# Altium project Virtex.PrjPcb (part 3 of 3)

## Sheet BoardB-USB.SchDoc
size A; SheetNumber: 6; SheetTotal: 9
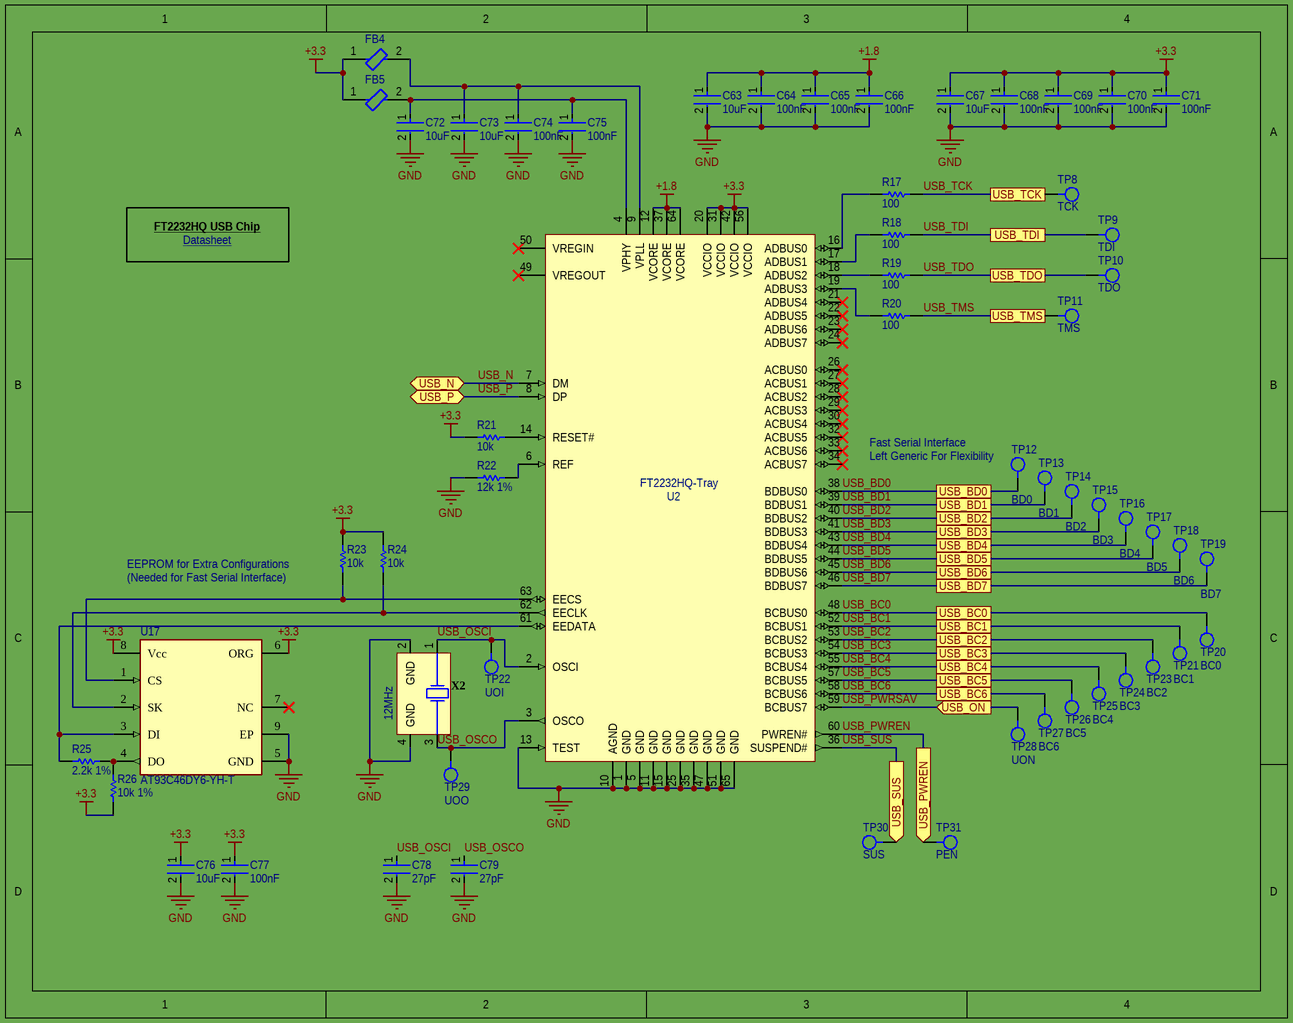
[diagram p5: BoardB-USB.SchDoc]

### Parts
C63  10uF  [FP-GRM188-0_1-e0_2_0_55-IPC_A]
C64  100nF  [FP-CGA3E-0_3-0_1-IPC_A]
C65  100nF  [FP-CGA3E-0_3-0_1-IPC_A]
C66  100nF  [FP-CGA3E-0_3-0_1-IPC_A]
C67  10uF  [FP-GRM188-0_1-e0_2_0_55-IPC_A]
C68  100nF  [FP-CGA3E-0_3-0_1-IPC_A]
C69  100nF  [FP-CGA3E-0_3-0_1-IPC_A]
C70  100nF  [FP-CGA3E-0_3-0_1-IPC_A]
C71  100nF  [FP-CGA3E-0_3-0_1-IPC_A]
C72  10uF  [FP-GRM188-0_1-e0_2_0_55-IPC_A]
C73  10uF  [FP-GRM188-0_1-e0_2_0_55-IPC_A]
C74  100nF  [FP-CGA3E-0_3-0_1-IPC_A]
C75  100nF  [FP-CGA3E-0_3-0_1-IPC_A]
C76  10uF  [FP-GRM188-0_1-e0_2_0_55-IPC_A]
C77  100nF  [FP-CGA3E-0_3-0_1-IPC_A]
C78  27pF  [FP-C0402-BB-MFG]
C79  27pF  [FP-C0402-BB-MFG]
FB4  BLM18AG601SN1D  [FP-BLM18-0_15-t0_8-MFG]  (value not drawn)
FB5  BLM18AG601SN1D  [FP-BLM18-0_15-t0_8-MFG]  (value not drawn)
R17  100  [RESC1005X40X25ML05T10]
R18  100  [RESC1005X40X25ML05T10]
R19  100  [RESC1005X40X25ML05T10]
R20  100  [RESC1005X40X25ML05T10]
R21  10k  [RESC1005X40X25LL05T05]
R22  12k 1%  [RESC1005X40X25ML05T05]
R23  10k  [RESC1005X40X25LL05T05]
R24  10k  [RESC1005X40X25LL05T05]
R25  2.2k 1%  [RESC1005X40X25NL05T10]
R26  10k 1%  [RESC1005X40X25LL05T05]
TP8  TCK  [TestPoint1mm]
TP9  TDI  [TestPoint1mm]
TP10  TDO  [TestPoint1mm]
TP11  TMS  [TestPoint1mm]
TP12  BD0  [TestPoint1mm]
TP13  BD1  [TestPoint1mm]
TP14  BD2  [TestPoint1mm]
TP15  BD3  [TestPoint1mm]
TP16  BD4  [TestPoint1mm]
TP17  BD5  [TestPoint1mm]
TP18  BD6  [TestPoint1mm]
TP19  BD7  [TestPoint1mm]
TP20  BC0  [TestPoint1mm]
TP21  BC1  [TestPoint1mm]
TP22  UOI  [TestPoint1mm]
TP23  BC2  [TestPoint1mm]
TP24  BC3  [TestPoint1mm]
TP25  BC4  [TestPoint1mm]
TP26  BC5  [TestPoint1mm]
TP27  BC6  [TestPoint1mm]
TP28  UON  [TestPoint1mm]
TP29  UOO  [TestPoint1mm]
TP30  SUS  [TestPoint1mm]
TP31  PEN  [TestPoint1mm]
U2  FT2232HQ-Tray  [QFN64_2_N]
U17  AT93C46DY6-YH-T  [FP-C04-21355-Q4B-IPC_C]
X2  ABM8G-12.000MHZ-4Y-T3  [ABM8G-12.000MHZ-4Y-T3]  (value not drawn)

### Ports
USB_BC0, USB_BC1, USB_BC2, USB_BC3, USB_BC4, USB_BC5, USB_BC6, USB_BD0, USB_BD1, USB_BD2, USB_BD3, USB_BD4, USB_BD5, USB_BD6, USB_BD7, USB_N (bidir), USB_ON (in), USB_P (bidir), USB_PWREN (out), USB_SUS (out), USB_TCK, USB_TDI, USB_TDO, USB_TMS

### Nets
+1.8: C63.1 C64.1 C65.1 C66.1 U2.12(VCORE) U2.37(VCORE) U2.64(VCORE)
+3.3: C67.1 C68.1 C69.1 C70.1 C71.1 C76.1 C77.1 FB4.1 FB5.1 R21.2 R23.2 R24.2 R26.1 U2.20(VCCIO) U2.31(VCCIO) U2.42(VCCIO) U2.56(VCCIO) U17.6(ORG) U17.8(Vcc)
GND: C63.2 C64.2 C65.2 C66.2 C67.2 C68.2 C69.2 C70.2 C71.2 C72.2 C73.2 C74.2 C75.2 C76.2 C77.2 C78.2 C79.2 R22.1 U2.1(GND) U2.5(GND) U2.10(AGND) U2.11(GND) U2.13(TEST) U2.15(GND) U2.25(GND) U2.35(GND) U2.47(GND) U2.51(GND) U2.65(GND) U17.5(GND) U17.9(EP) X2.2(GND) X2.4(GND)
USB_BC0: TP20.1 U2.48(BCBUS0) ; port USB_BC0
USB_BC1: TP21.1 U2.52(BCBUS1) ; port USB_BC1
USB_BC2: TP23.1 U2.53(BCBUS2) ; port USB_BC2
USB_BC3: TP24.1 U2.54(BCBUS3) ; port USB_BC3
USB_BC4: TP25.1 U2.55(BCBUS4) ; port USB_BC4
USB_BC5: TP26.1 U2.57(BCBUS5) ; port USB_BC5
USB_BC6: TP27.1 U2.58(BCBUS6) ; port USB_BC6
USB_BD0: TP12.1 U2.38(BDBUS0) ; port USB_BD0
USB_BD1: TP13.1 U2.39(BDBUS1) ; port USB_BD1
USB_BD2: TP14.1 U2.40(BDBUS2) ; port USB_BD2
USB_BD3: TP15.1 U2.41(BDBUS3) ; port USB_BD3
USB_BD4: TP16.1 U2.43(BDBUS4) ; port USB_BD4
USB_BD5: TP17.1 U2.44(BDBUS5) ; port USB_BD5
USB_BD6: TP18.1 U2.45(BDBUS6) ; port USB_BD6
USB_BD7: TP19.1 U2.46(BDBUS7) ; port USB_BD7
USB_N: U2.7(DM) ; port USB_N
USB_OSCI: C78.1 TP22.1 U2.2(OSCI) X2.1
USB_OSCO: C79.1 TP29.1 U2.3(OSCO) X2.3
USB_P: U2.8(DP) ; port USB_P
USB_PWREN: TP31.1 U2.60(PWREN#) ; port USB_PWREN
USB_PWRSAV: TP28.1 U2.59(BCBUS7) ; port USB_ON
USB_SUS: TP30.1 U2.36(SUSPEND#) ; port USB_SUS
USB_TCK: R17.2 TP8.1 ; port USB_TCK
USB_TDI: R18.2 TP9.1 ; port USB_TDI
USB_TDO: R19.2 TP10.1 ; port USB_TDO
USB_TMS: R20.2 TP11.1 ; port USB_TMS
NetC72_1: C72.1 C75.1 FB5.2 U2.4(VPHY)
NetC73_1: C73.1 C74.1 FB4.2 U2.9(VPLL)
NetR17_1: R17.1 U2.16(ADBUS0)
NetR18_1: R18.1 U2.17(ADBUS1)
NetR19_1: R19.1 U2.18(ADBUS2)
NetR20_1: R20.1 U2.19(ADBUS3)
NetR21_1: R21.1 U2.14(RESET#)
NetR22_2: R22.2 U2.6(REF)
NetR23_1: R23.1 U2.63(EECS) U17.1(CS)
NetR24_1: R24.1 U2.62(EECLK) U17.2(SK)
NetR25_1: R25.1 U2.61(EEDATA) U17.3(DI)
NetR25_2: R25.2 R26.2 U17.4(DO)

Not connected (* = marked no-connect by the designer): U2 21(ADBUS4)* 22(ADBUS5)* 23(ADBUS6)* 24(ADBUS7)* 26(ACBUS0)* 27(ACBUS1)* 28(ACBUS2)* 29(ACBUS3)* 30(ACBUS4)* 32(ACBUS5)* 33(ACBUS6)* 34(ACBUS7)* 49(VREGOUT)* 50(VREGIN)*; U17 7(NC)*

### Notes on the sheet
- FT2232HQ USB Chip
- Datasheet <https://www.ftdichip.com/Support/Documents/DataSheets/ICs/DS_FT2232H.pdf>
- Fast Serial Interface
- (near TP12) Left Generic For Flexibility
- (near R23) EEPROM for Extra Configurations
- (near R23) (Needed for Fast Serial Interface)
- (near X2) 12MHz

### Library data of the parts
C63 C67 C72 C73 C76 = CMP-2006-02792-2: as C1 on sheet BoardA-Connectors; Packaging: Tape and Reel; Voltage Rating (DC): 6.3V; Width: 0.031inch; Termination: SMD/SMT; Dielectric: X5R; Package Quantity: 4000; Voltage Rating: 6.3V; Capacitance: 10uF; Case/Package: 0603; Min Operating Temperature: -55°C; Voltage: 6.3V; Length: 1.6mm; Thickness: 0.035inch; Lead Free: Lead Free; Depth: 0.8mm; Case Code (Imperial): 0603; Max Operating Temperature: 85°C; Material: Ceramic; Height: 0.8mm; Tolerance: 20%; Mount: Surface Mount; REACH SVHC: No SVHC; Radiation Hardening: No; Case Code (Metric): 1608
C64-C66 C68-C71 C74 C75 C77 = CMP-2000-07546-2: as C96 on sheet BoardA-Power; Weight: 7.1E-05oz; Composition: Ceramic; Max Operating Temperature: 125°C; Termination: SMD/SMT; Dielectric: X7R; Length: 1.6mm; Package Quantity: 1; REACH SVHC: No SVHC; Lead Free: Lead Free; Case Code (Metric): 1608; Min Operating Temperature: -55°C; Packaging: Tape and Reel; Tolerance: 10%; Voltage Rating: 50V; Case Code (Imperial): 0603; Capacitance: 100nF; Case/Package: 0603; Voltage Rating (DC): 50V; Depth: 0.8mm; Radiation Hardening: No; Ratings: AEC-Q200; Mount: Surface Mount; Voltage: 50V; Thickness: 0.035inch; Width: 0.8mm; Height: 0.8mm
C78 C79 = CMP-1034-00963-6: CAP CER 27PF 50V C0G/NP0 0402; Manufacturer: Kemet; Manufacturer Part Number: C0402C270J5GACTU; Temperature Coefficient: 15%; Tolerance: 0.05; Temperature Characteristic: C0G; Material: Ceramic; Device Class L1: Passive Components; Device Class L3: Ceramic Capacitors; RoHS: TRUE; Height: 0.55mm; Value: 27 pF; Device Class L2: Capacitors; Capacitance: 27 pF; Automotive: No; Octopart: https://octopart.com/c0402c270j5gactu-kemet-149444; Temperature: -55°C to +125°C; Temperature Range Low: -55°C; Package: C0402-BB; Ipc Land Pattern Name: CAPC10050X50; Category: Cap; Lead Free: Yes; Temperature Range High: +125°C; ComponentLink2URL: https://content.kemet.com/datasheets/KEM_C1002_X7R_SMD.pdf; ComponentLink2Description: Datasheet; Mouser Description: Multilayer Ceramic Capacitor, C Series, 27 pF, - 5%, C0G / NP0, 50 V, 0402 [1005 Metric]; Digikey Description: CAP CER 27PF 50V C0G/NP0 0402; Voltage Rating: 50 V
FB4 FB5 = CMP-0686-00436-3: Chip Ferrite Bead, 0603, 600Ω @ 100MHz, 0.38Ω, 25%, 500mA; Number of Lines: 1; Impedance: 600R; DC Resistance (DCR): 380mR; Material: Steel; Shielding: Unshielded; Max DC Current: 500mA; Termination: SMD/SMT; Military Standard: Not; Number of Circuits: 1; Min Operating Temperature: -55°C; Case Code (Imperial): 0603; Width: 0.8mm; Current Rating: 500mA; Lead Free: Lead Free; Packaging: Tape and Reel; Frequency: 100MHz; Max Operating Temperature: 125°C; DC Current: 500mA; REACH SVHC: No SVHC; Case/Package: 0603; Package Quantity: 1; Height: 0.8mm; Number of Pins: 2; Depth: 0.8mm; Test Frequency: 100MHz; Case Code (Metric): 1608; Tolerance: 25%; Core Material: Ferrite; Weight: 7.1E-05oz; Max Current Rating: 500mA; Radiation Hardening: No; Length: 1.6mm; RoHS Compliant: Yes
R17-R20 = CMP-2002-07344-1: Part Number: RC0402FR-07100RL; Manufacturer: Yageo / Phycomp
R21 R23 R24 R26 = CMP-2000-07588-1: Chip Resistor, 10 KOhm, +/- 1%, 0.1 W, -55 to 155 degC, 0402 (1005 Metric), RoHS, Tape and Reel; Manufacturer: Panasonic; Power Rating: 100mW; Voltage Rating: 50V; Resistance: 10KOhm; Case\/Package: 0402; Temperature Coefficient: 100ppm\/degreesC; RoHSCompliant: True; Lead Free: LeadFree; Package Quantity: 1; Contact Plating: Tin; Length: 1mm; Radiation Hardening: No; REACH SVHC: NoSVHC; Max Operating Temperature: 155degC; Depth: 0.5mm; Case Code (Imperial): 0402; Military Standard: Not; Package Description: 2-Pin Surface Mount Device, Body 1 x 0.5 mm; Termination: SMD/SMT; Case Code (Metric): 1005; Height: 0.35mm; Packaging: TapeandReel; Voltage Rating (DC): 50V; Package Reference: 402; Number of Pins: 2; Tolerance: 1%; Mounting Technology: SurfaceMount; Width: 0.02inch; Mount: SurfaceMount; Datasheet URL: https://industrial.panasonic.com/cdbs/www-data/pdf/RDA0000/AOA0000C304.pdf; Composition: ThickFilm; Datasheet Version: 02/2017; Manufacturer URL: http://www.panasonic.com/; Max Power Dissipation: 100mW; Number of Terminations: 2; Min Operating Temperature: -55degC
R22 = CMP-2002-00646-4: Chip Resistor, 12 KOhm, +/- 1%, 0.1 W, -55 to 155 degC, 0402 (1005 Metric), RoHS, Tape and Reel; PartNumber: ERJ-2RKF1202X; Resistance: 12 KOhm; Voltage Rating: 50 V; Case\/Package: 0402; Power Rating: 100 mW; Length: 1 mm; PackageReference: 0402; DatasheetVersion: 04/2015; ComponentLink2Description: Datasheet; ComponentLink1URL: http://www.panasonic.com/; Pins: 2; Width: 0.5 mm; REACH SVHC: Yes; Packaging: Tape and Reel; Min Operating Temperature: -55 degC; Mounting Technology: Surface Mount; Max Operating Temperature: 155 degC; Case Code (Imperial): 0402; Height: 0.35 mm; Tolerance: 1%; PackageDescription: 2-Pin Surface Mount Device, Body 1 x 0.5 mm; RoHSCompliant: true; ComponentLink1Description: Manufacturer URL; Mount: Surface Mount; ComponentLink2URL: http://industrial.panasonic.com/cdbs/www-data/pdf/RDA0000/AOA0000C86.pdf; Package Quantity: 10000; Case Code (Metric): 1005
R25 = CMP-2002-07567-1: Manufacturer: Yageo / Phycomp; Part Number: RC0402FR-072K2L
TP8-TP31 = TestPoint1mm: Test Point 1mm Diameter
U2 = CMP-0078-00003-3: Dual High Speed USB To Multipurpose UART/FIFO IC, 64-pin QFN, Tray; Manufacturer: FTDI; PackageVersion: Jun-12; ComponentLink2URL: http://www.ftdichip.com/Support/Documents/DataSheets/ICs/DS_FT2232H.pdf; ComponentLink1Description: Manufacturer URL; RevisionNote: DatasheetVersion updated to 2.21 Jun-2012; PackageReference: QFN64_2; PackageDescription: 64-Pin Quad Flat No-Lead, 9 x 9 mm Body, 0.5 mm Pitch, 4.35 x 4.35 mm Exposed Pad; ComponentLink2Description: Datasheet; ComponentLink1URL: http://www.ftdichip.com/; PartNumber: FT2232HQ-Tray; DatasheetVersion: ver 2.21, Jun-2012
U17 = CMP-06313-000080-1: IC EEPROM 1KBIT SPI 8MINI MAP; Frequency: 2MHz; Memory Type: Non-Volatile; Memory Size: 1Kb; Max Operating Temperature: 85°C; RoHS Compliant: Yes; Packaging: Tape and Reel; Min Operating Temperature: -40°C; Mount: Surface Mount
X2 = ABM8G-12.000MHZ-4Y-T3: ABRACON - ABM8G-12.000MHZ-4Y-T3 - CRYSTAL, 12MHZ, 10PF, 3.2 X 2.5MM; ESR (Equivalent Series Resistance): 120R; Frequency Tolerance: 30ppm; Supplier 1: Digi-Key; RoHS: Yes; Stock 1: 11481; Pricing 1: 1=0.67000, 10=0.59600, 50=0.55720, 100=0.49250, 500=0.46656, 1000=0.38880 (USD); Mount: Surface Mount; Case/Package: CSMD; Number of Pins: 4; Min Operating Temperature: -10°C; Max Operating Temperature: 60°C; Frequency: 12MHz; Load Capacitance: 10pF; Packaging: Tape and Reel; Frequency Stability: 30ppm; Series: ABM8G; Series Resistance: 120R; Operating Frequency: 12 MHz; Length: 3.2mm; Width: 0.098inch; Height: 0.039inch; Depth: 2.5mm; REACH SVHC: No SVHC; Lead Free: Lead Free; ComponentLink1URL: https://datasheet.ciiva.com/15116/getdatasheetpartid-719872-15116768.pdf?src-supplier=Verical; ComponentLink1Description: https://datasheet.ciiva.com/15116/getdatasheetpartid-719872-15116768.pdf?src-supplier=Verical; ComponentLink2URL: https://datasheet.ciiva.com/857/abm8g-857959.pdf?src-supplier=Digi-Key; ComponentLink2Description: https://datasheet.ciiva.com/857/abm8g-857959.pdf?src-supplier=Digi-Key; ComponentLink3URL: https://datasheet.ciiva.com/857/abm8g-857960.pdf?src-supplier=Digi-Key; ComponentLink3Description: https://datasheet.ciiva.com/857/abm8g-857960.pdf?src-supplier=Digi-Key; ComponentLink4URL: https://datasheet.ciiva.com/857/abm8g-857961.pdf?src-supplier=Digi-Key; ComponentLink4Description: https://datasheet.ciiva.com/857/abm8g-857961.pdf?src-supplier=Digi-Key; ComponentLink5URL: https://datasheet.ciiva.com/16216/abm8g-16216655.pdf?src-supplier=Future+Electronics; ComponentLink5Description: https://datasheet.ciiva.com/16216/abm8g-16216655.pdf?src-supplier=Future+Electronics; Manufacturer Part Number: ABM8G-12.000MHZ-4Y-T3; Manufacturer: Abracon; Supplier Part Number 1: 535-10901-1-ND; Category: Crystals

## Sheet BoardB-Camera.SchDoc
size A; SheetNumber: 7; SheetTotal: 9
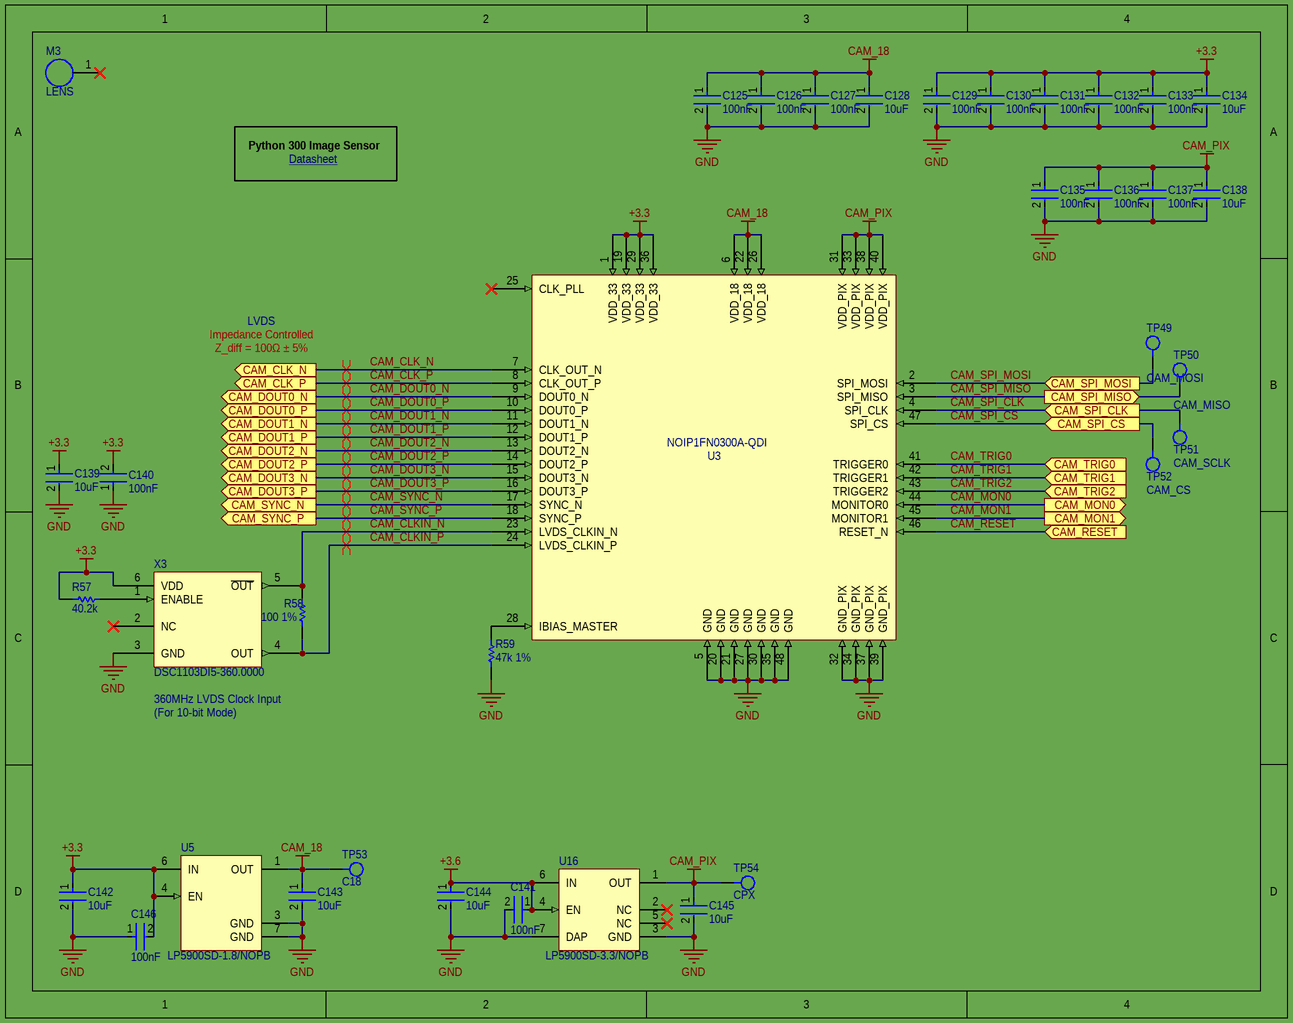
[diagram p6: BoardB-Camera.SchDoc]

### Parts
(Parts that share a designator on the sheet are numbered #1, #2 ... from top to bottom, then left to right.)
C125  100nF  [FP-CGA3E-0_3-0_1-IPC_A]
C126  100nF  [FP-CGA3E-0_3-0_1-IPC_A]
C127  100nF  [FP-CGA3E-0_3-0_1-IPC_A]
C128  10uF  [FP-GRM188-0_1-e0_2_0_55-IPC_A]
C129  100nF  [FP-CGA3E-0_3-0_1-IPC_A]
C130  100nF  [FP-CGA3E-0_3-0_1-IPC_A]
C131  100nF  [FP-CGA3E-0_3-0_1-IPC_A]
C132  100nF  [FP-CGA3E-0_3-0_1-IPC_A]
C133  100nF  [FP-CGA3E-0_3-0_1-IPC_A]
C134  10uF  [FP-GRM188-0_1-e0_2_0_55-IPC_A]
C135  100nF  [FP-CGA3E-0_3-0_1-IPC_A]
C136  100nF  [FP-CGA3E-0_3-0_1-IPC_A]
C137  100nF  [FP-CGA3E-0_3-0_1-IPC_A]
C138  10uF  [FP-GRM188-0_1-e0_2_0_55-IPC_A]
C139  10uF  [FP-GRM188-0_1-e0_2_0_55-IPC_A]
C140  100nF  [FP-CGA3E-0_3-0_1-IPC_A]
C141  100nF  [FP-CGA3E-0_3-0_1-IPC_A]
C142  10uF  [FP-GRM188-0_1-e0_2_0_55-IPC_A]
C143  10uF  [FP-GRM188-0_1-e0_2_0_55-IPC_A]
C144  10uF  [FP-GRM188-0_1-e0_2_0_55-IPC_A]
C145  10uF  [FP-GRM188-0_1-e0_2_0_55-IPC_A]
C146  100nF  [FP-CGA3E-0_3-0_1-IPC_A]
M3  LENS  [LENS_MNT]
R57  40.2k  [RESC1005X40X25LL05T05]
R58  100 1%  [RESC1005X40X25LL05T05]
R59  47k 1%  [RESC1005X40X25NL05T05]
TP49  CAM_MOSI  [TestPoint1mm]
TP50  CAM_MISO  [TestPoint1mm]
TP51  CAM_SCLK  [TestPoint1mm]
TP52  CAM_CS  [TestPoint1mm]
TP53  C18  [TestPoint1mm]
TP54  CPX  [TestPoint1mm]
U3  NOIP1FN0300A-QDI  [NOIP1FN0300A-QDI]
U5#2  LP5900SD-1.8/NOPB  [LP5900-WSON]
U16  LP5900SD-3.3/NOPB  [NGF0006A_V]
X3  DSC1103DI5-360.0000  [DSC1103DI5-360.0000]

### Ports
CAM_CLK_N (out), CAM_CLK_P (out), CAM_DOUT0_N (out), CAM_DOUT0_P (out), CAM_DOUT1_N (out), CAM_DOUT1_P (out), CAM_DOUT2_N (out), CAM_DOUT2_P (out), CAM_DOUT3_N (out), CAM_DOUT3_P (out), CAM_MON0 (out), CAM_MON1 (out), CAM_RESET (in), CAM_SPI_CLK (in), CAM_SPI_CS (in), CAM_SPI_MISO (out), CAM_SPI_MOSI (in), CAM_SYNC_N (out), CAM_SYNC_P (out), CAM_TRIG0 (in), CAM_TRIG1 (in), CAM_TRIG2 (in)

### Nets
+3.3: C129.1 C130.1 C131.1 C132.1 C133.1 C134.1 C139.1 C140.2 C142.1 C146.2 R57.1 U3.1(VDD_33) U3.19(VDD_33) U3.29(VDD_33) U3.36(VDD_33) U5#2.4(EN) U5#2.6(IN) X3.6(VDD)
+3.6: C141.1 C144.1 U16.4(EN) U16.6(IN)
CAM_18: C125.1 C126.1 C127.1 C128.1 C143.1 TP53.1 U3.6(VDD_18) U3.22(VDD_18) U3.26(VDD_18) U5#2.1(OUT)
CAM_PIX: C135.1 C136.1 C137.1 C138.1 C145.1 TP54.1 U3.31(VDD_PIX) U3.33(VDD_PIX) U3.38(VDD_PIX) U3.40(VDD_PIX) U16.1(OUT)
GND: C125.2 C126.2 C127.2 C128.2 C129.2 C130.2 C131.2 C132.2 C133.2 C134.2 C135.2 C136.2 C137.2 C138.2 C139.2 C140.1 C141.2 C142.2 C143.2 C144.2 C145.2 C146.1 R59.1 U3.5(GND) U3.20(GND) U3.21(GND) U3.27(GND) U3.30(GND) U3.32(GND_PIX) U3.34(GND_PIX) U3.35(GND) U3.37(GND_PIX) U3.39(GND_PIX) U3.48(GND) U5#2.3(GND) U5#2.7(GND) U16.3(GND) U16.7(DAP) X3.3(GND)
CAM_CLK_N: U3.7(CLK_OUT_N) ; port CAM_CLK_N
CAM_CLK_P: U3.8(CLK_OUT_P) ; port CAM_CLK_P
CAM_CLKIN_N: R58.2 U3.23(LVDS_CLKIN_N) X3.5(~{OUT})
CAM_CLKIN_P: R58.1 U3.24(LVDS_CLKIN_P) X3.4(OUT)
CAM_DOUT0_N: U3.9(DOUT0_N) ; port CAM_DOUT0_N
CAM_DOUT0_P: U3.10(DOUT0_P) ; port CAM_DOUT0_P
CAM_DOUT1_N: U3.11(DOUT1_N) ; port CAM_DOUT1_N
CAM_DOUT1_P: U3.12(DOUT1_P) ; port CAM_DOUT1_P
CAM_DOUT2_N: U3.13(DOUT2_N) ; port CAM_DOUT2_N
CAM_DOUT2_P: U3.14(DOUT2_P) ; port CAM_DOUT2_P
CAM_DOUT3_N: U3.15(DOUT3_N) ; port CAM_DOUT3_N
CAM_DOUT3_P: U3.16(DOUT3_P) ; port CAM_DOUT3_P
CAM_MON0: U3.44(MONITOR0) ; port CAM_MON0
CAM_MON1: U3.45(MONITOR1) ; port CAM_MON1
CAM_RESET: U3.46(RESET_N) ; port CAM_RESET
CAM_SPI_CLK: TP51.1 U3.4(SPI_CLK) ; port CAM_SPI_CLK
CAM_SPI_CS: TP52.1 U3.47(SPI_CS) ; port CAM_SPI_CS
CAM_SPI_MISO: TP50.1 U3.3(SPI_MISO) ; port CAM_SPI_MISO
CAM_SPI_MOSI: TP49.1 U3.2(SPI_MOSI) ; port CAM_SPI_MOSI
CAM_SYNC_N: U3.17(SYNC_N) ; port CAM_SYNC_N
CAM_SYNC_P: U3.18(SYNC_P) ; port CAM_SYNC_P
CAM_TRIG0: U3.41(TRIGGER0) ; port CAM_TRIG0
CAM_TRIG1: U3.42(TRIGGER1) ; port CAM_TRIG1
CAM_TRIG2: U3.43(TRIGGER2) ; port CAM_TRIG2
NetR57_2: R57.2 X3.1(ENABLE)
NetR59_2: R59.2 U3.28(IBIAS_MASTER)

Not connected (* = marked no-connect by the designer): M3 1*; U3 25(CLK_PLL)*; U16 2(NC)* 5(NC)*; X3 2(NC)*

### Layout directives
differential pair; differential pair class CAM_CLK_OUT; rule Signal Stimulus [Kind - Single Pulse    Level - High    Start Time = 0.000    Stop Time = 1.389n    Period Time = 2.778n]: CAM_CLK_N, CAM_CLK_P
differential pair; differential pair class CAM_DOUT0; rule Signal Stimulus [Kind - Single Pulse    Level - High    Start Time = 0.000    Stop Time = 1.389n    Period Time = 2.778n]: CAM_DOUT0_N, CAM_DOUT0_P
differential pair; differential pair class CAM_DOUT1; rule Signal Stimulus [Kind - Single Pulse    Level - High    Start Time = 0.000    Stop Time = 1.389n    Period Time = 2.778n]: CAM_DOUT1_N, CAM_DOUT1_P
differential pair; differential pair class CAM_DOUT2; rule Signal Stimulus [Kind - Single Pulse    Level - High    Start Time = 0.000    Stop Time = 1.389n    Period Time = 2.778n]: CAM_DOUT2_N, CAM_DOUT2_P
differential pair; differential pair class CAM_DOUT3; rule Signal Stimulus [Kind - Single Pulse    Level - High    Start Time = 0.000    Stop Time = 1.389n    Period Time = 2.778n]: CAM_DOUT3_N, CAM_DOUT3_P
differential pair; differential pair class CAM_SYNC; rule Signal Stimulus [Kind - Single Pulse    Level - High    Start Time = 0.000    Stop Time = 1.389n    Period Time = 2.778n]: CAM_SYNC_N, CAM_SYNC_P
differential pair; differential pair class CAM_CLKIN: CAM_CLKIN_N, CAM_CLKIN_P

### Notes on the sheet
- Python 300 Image Sensor
- Datasheet <https://www.onsemi.com/pdf/datasheet/noip1sn1300a-d.pdf>
- LVDS
- Impedance Controlled
- Z_diff = 100Ω ± 5%
- (near X3) 360MHz LVDS Clock Input
- (For 10-bit Mode)

### Library data of the parts
C125-C127 C129-C133 C135-C137 C140 C141 C146 = CMP-2000-07546-2: Cap Ceramic 100nF 50V X7R 10% Pad SMD 0603 +125°C Automotive T/R; Weight: 7.1E-05oz; Composition: Ceramic; Max Operating Temperature: 125°C; Termination: SMD/SMT; Dielectric: X7R; Length: 1.6mm; Package Quantity: 1; REACH SVHC: No SVHC; Lead Free: Lead Free; Case Code (Metric): 1608; Min Operating Temperature: -55°C; Packaging: Tape and Reel; Tolerance: 10%; Voltage Rating: 50V; Case Code (Imperial): 0603; Capacitance: 100nF; Case/Package: 0603; Voltage Rating (DC): 50V; Depth: 0.8mm; Radiation Hardening: No; Ratings: AEC-Q200; Mount: Surface Mount; Voltage: 50V; Thickness: 0.035inch; Width: 0.8mm; Height: 0.8mm
C128 C134 C138 C139 C142-C145 = CMP-2006-02792-2: Chip Multilayer Ceramic Capacitors for General Purpose, 0603, 10uF, X5R, 15%, 20%, 6.3V; Packaging: Tape and Reel; Voltage Rating (DC): 6.3V; Width: 0.031inch; Termination: SMD/SMT; Dielectric: X5R; Package Quantity: 4000; Voltage Rating: 6.3V; Capacitance: 10uF; Case/Package: 0603; Min Operating Temperature: -55°C; Voltage: 6.3V; Length: 1.6mm; Thickness: 0.035inch; Lead Free: Lead Free; Depth: 0.8mm; Case Code (Imperial): 0603; Max Operating Temperature: 85°C; Material: Ceramic; Height: 0.8mm; Tolerance: 20%; Mount: Surface Mount; REACH SVHC: No SVHC; Radiation Hardening: No; Case Code (Metric): 1608
M3 = LENS_MNT
R57 = CMP-2002-00919-1: Manufacturer: Panasonic; Part Number: ERJ-2RKF4022X
R58 = CMP-2002-00605-3: Chip Resistor, 100 Ohm, +/- 1%, 100 mW, -55 to 155 degC, 0402 (1005 Metric), RoHS, Tape and Reel; Manufacturer: Basic Passives; PartNumber: ERJ-2RKF1000X; Power Rating: 100 mW; Resistance: 100 Ohm; Voltage Rating: 50 V; Case\/Package: 0402; Width: 0.5 mm; Pins: 2; ComponentLink2Description: Datasheet; PackageReference: 0402; Height: 0.35 mm; Tolerance: 1%; DatasheetVersion: 04/2015; Case Code (Imperial): 0402; Min Operating Temperature: -55 degC; Radiation Hardening: No; Length: 1 mm; Package Quantity: 10000; PackageDescription: 2-Pin Surface Mount Device, Body 1 x 0.5 mm; Mounting Technology: Surface Mount; Case Code (Metric): 1005; Packaging: Tape and Reel; ComponentLink1URL: http://www.panasonic.com/; RoHSCompliant: true; Max Operating Temperature: 155 degC; REACH SVHC: Yes; ComponentLink1Description: Manufacturer URL; ComponentLink2URL: http://industrial.panasonic.com/cdbs/www-data/pdf/RDA0000/AOA0000C86.pdf; Mount: Surface Mount
R59 = CMP-2002-01155-1: Part Number: ERJ2RKF4702X; Manufacturer: Panasonic
TP49-TP54 = TestPoint1mm: Test Point 1mm Diameter
U3 = NOIP1FN0300A-QDI: IC IMAGE SENSOR 0.3MP 48LCC; Manufacturer: ON Semiconductor; Operating Supply Voltage: 3.4V; Supplier 1: Avnet; Manufacturer Part Number: NOIP1FN0300A-QDI; RoHS: Yes; Category: Optoelectronics; Pricing 1: 6=58.23675, 8=57.37875, 20=56.62800, 30=55.87725, 60=55.12650, 300=53.83950, 600=53.41050 (USD); Mount: Surface Mount; Case/Package: LCC; Number of Pins: 48; Min Operating Temperature: -40°C; Max Operating Temperature: 85°C; Lead Free: Lead Free; RoHS Compliant: Yes; ComponentLink1URL: http://www.onsemi.com/pub_link/Collateral/PB_NOIP1SN1300A-D.PDF?src-supplier=Digi-Key; ComponentLink1Description: http://www.onsemi.com/pub_link/Collateral/PB_NOIP1SN1300A-D.PDF?src-supplier=Digi-Key; ComponentLink2URL: http://www.onsemi.com/pub_link/Collateral/NOIP1SN1300A-D.PDF?src-supplier=Avnet+Asia; ComponentLink2Description: http://www.onsemi.com/pub_link/Collateral/NOIP1SN1300A-D.PDF?src-supplier=Avnet+Asia; Supplier Part Number 1: NOIP1FN0300A-QDI
U5#2 = LP5900SD-1.8/NOPB: TEXAS INSTRUMENTS         LP5900SD-1.8/NOPB.             LDO VOLTAGE REGULATOR, 3.3V, 150mA, LLP-6, FULL REEL; Output Voltage: 1.8V; Min Input Voltage: 2.5V; Max Input Voltage: 5.5V; Number of Outputs: 1; Polarity: Positive; Quiescent Current: 50uA; Accuracy: 2%; Output Type: Fixed; Dropout Voltage: 150mV; Supplier 1: Digi-Key; RoHS: Yes; Stock 1: 9836; Pricing 1: 1=0.87000, 10=0.77000, 25=0.72280, 100=0.59000, 250=0.54800, 500=0.46640 (USD); Mount: Surface Mount; Number of Pins: 6; Min Operating Temperature: -40°C; Max Operating Temperature: 125°C; Output Current: 150mA; Package Quantity: 1000; Max Output Current: 150mA; Nominal Output Voltage: 1.8V; Packaging: Tape and Reel; Output Voltage Accuracy: 2%; Length: 2.2mm; Width: 2.5mm; Height: 0.8mm; Radiation Hardening: No; REACH SVHC: No SVHC; Lead Free: Lead Free; RoHS Compliant: Yes; ComponentLink1URL: https://datasheet.ciiva.com/6598/lp5900-6598182.pdf?src-supplier=Digi-Key; ComponentLink1Description: https://datasheet.ciiva.com/6598/lp5900-6598182.pdf?src-supplier=Digi-Key; ComponentLink2URL: https://datasheet.ciiva.com/6598/lp5900-6598185.pdf?src-supplier=Digi-Key; ComponentLink2Description: https://datasheet.ciiva.com/6598/lp5900-6598185.pdf?src-supplier=Digi-Key; ComponentLink3URL: https://datasheet.ciiva.com/6598/lp5900-6598187.pdf?src-supplier=Digi-Key; ComponentLink3Description: https://datasheet.ciiva.com/6598/lp5900-6598187.pdf?src-supplier=Digi-Key; ComponentLink4URL: https://datasheet.ciiva.com/26175/lp5900-26175289.pdf?src-supplier=Avnet+Europe; ComponentLink4Description: https://datasheet.ciiva.com/26175/lp5900-26175289.pdf?src-supplier=Avnet+Europe; ComponentLink5URL: https://datasheet.ciiva.com/14278/lp5900-14278125.pdf?src-supplier=Avnet; ComponentLink5Description: https://datasheet.ciiva.com/14278/lp5900-14278125.pdf?src-supplier=Avnet; ComponentLink6URL: https://datasheet.ciiva.com/28643/1772310-28643116.pdf?src-supplier=Element14; ComponentLink6Description: https://datasheet.ciiva.com/28643/1772310-28643116.pdf?src-supplier=Element14; ComponentLink7URL: https://datasheet.ciiva.com/22678/1772310-22678013.pdf?src-supplier=Element14; ComponentLink7Description: https://datasheet.ciiva.com/22678/1772310-22678013.pdf?src-supplier=Element14; Category: Voltage Regulators - Linear; Manufacturer Part Number: LP5900SD-1.8/NOPB; Manufacturer: Texas Instruments; Supplier Part Number 1: LP5900SD-1.8/NOPBCT-ND
U16 = CMP-0062-01367-3: Ultra Low Noise, 150mA Linear Regulator for RF/Analog Circuits Requires No Bypass Capacitor, 6-pin LLP, Pb-Free; Manufacturer: Texas Instruments; PackageTopMarking: XTT*L16; CompType: LDO IC; PowerWise: N; ComponentLink1URL: http://www.ti.com/general/docs/lit/getliterature.tsp?genericPartNumber=LP5900&fileType=pdf; PinCount: 6; PackageDescription: LLP, Plastic, Dual, 2.2 x 2.5 x 0.8mm Body, 6 Lead, 0.65mm Pitch, No Pullback; RoHS: Y; ComponentLink1Description: Datasheet URL; PackageReference: NGF0006A
X3 = DSC1103DI5-360.0000: Mems Oscillator, Low Power, Lvds, -40C-85C, 10Ppm, 2.5X2.0Mm6 Vdfn 2.0X2.5Mm Tube; Manufacturer: Microchip; Supplier 1: Digi-Key; Manufacturer Part Number: DSC1103DI5-360.0000; RoHS: Yes; Category: Oscillators; Stock 1: 706; Pricing 1: 1=5.51000, 25=4.59000, 100=4.51500 (USD); RoHS Compliant: Yes; Supplier Part Number 1: DSC1103DI5-360.0000-ND

## Sheet BoardB-LEDs.SchDoc
size A; SheetNumber: 8; SheetTotal: 9
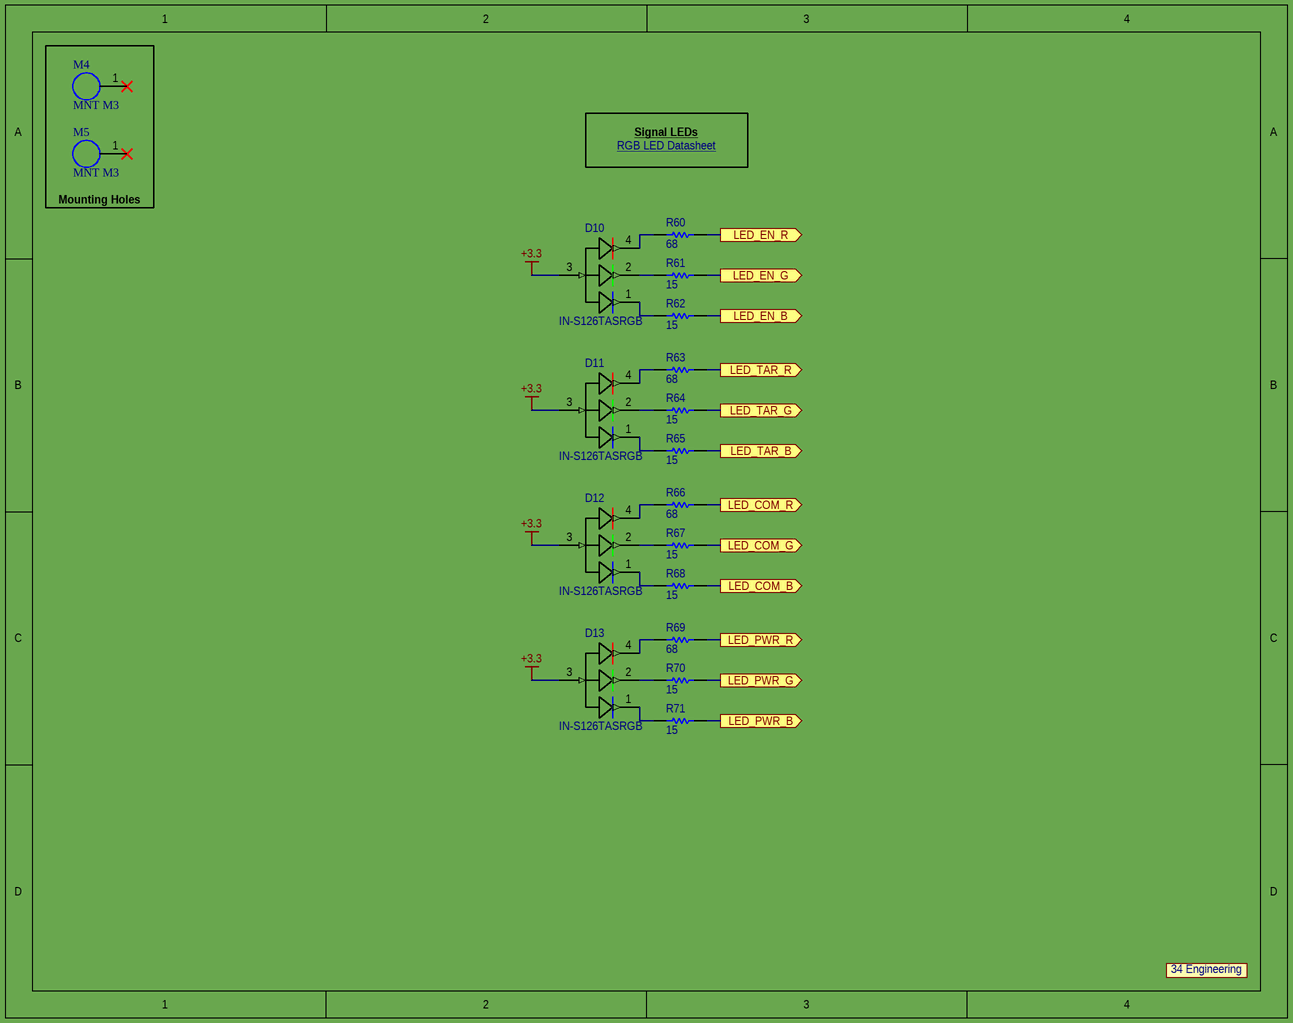
[diagram p7: BoardB-LEDs.SchDoc]

### Parts
D10  IN-S126TASRGB  [IN-S126TASRGB]
D11  IN-S126TASRGB  [IN-S126TASRGB]
D12  IN-S126TASRGB  [IN-S126TASRGB]
D13  IN-S126TASRGB  [IN-S126TASRGB]
LOGO1  34 Engineering Logo  [34EngineeringLogo]  (value not drawn)
M4  MNT M3  [MNT M3]
M5  MNT M3  [MNT M3]
R60  68  [RESC1005X40X25ML05T05]
R61  15  [RESC1005X40X25LL05T05]
R62  15  [RESC1005X40X25LL05T05]
R63  68  [RESC1005X40X25ML05T05]
R64  15  [RESC1005X40X25LL05T05]
R65  15  [RESC1005X40X25LL05T05]
R66  68  [RESC1005X40X25ML05T05]
R67  15  [RESC1005X40X25LL05T05]
R68  15  [RESC1005X40X25LL05T05]
R69  68  [RESC1005X40X25ML05T05]
R70  15  [RESC1005X40X25LL05T05]
R71  15  [RESC1005X40X25LL05T05]

### Blocks framed on the sheet
Mounting Holes: M4 M5

### Ports
LED_COM_B (out), LED_COM_G (out), LED_COM_R (out), LED_EN_B (out), LED_EN_G (out), LED_EN_R (out), LED_PWR_B (out), LED_PWR_G (out), LED_PWR_R (out), LED_TAR_B (out), LED_TAR_G (out), LED_TAR_R (out)

### Nets
+3.3: D10.3 D11.3 D12.3 D13.3
NetD10_1: D10.1 R62.1
NetD10_2: D10.2 R61.1
NetD10_4: D10.4 R60.1
NetD11_1: D11.1 R65.1
NetD11_2: D11.2 R64.1
NetD11_4: D11.4 R63.1
NetD12_1: D12.1 R68.1
NetD12_2: D12.2 R67.1
NetD12_4: D12.4 R66.1
NetD13_1: D13.1 R71.1
NetD13_2: D13.2 R70.1
NetD13_4: D13.4 R69.1
NetR60_2: R60.2 ; port LED_EN_R
NetR61_2: R61.2 ; port LED_EN_G
NetR62_2: R62.2 ; port LED_EN_B
NetR63_2: R63.2 ; port LED_TAR_R
NetR64_2: R64.2 ; port LED_TAR_G
NetR65_2: R65.2 ; port LED_TAR_B
NetR66_2: R66.2 ; port LED_COM_R
NetR67_2: R67.2 ; port LED_COM_G
NetR68_2: R68.2 ; port LED_COM_B
NetR69_2: R69.2 ; port LED_PWR_R
NetR70_2: R70.2 ; port LED_PWR_G
NetR71_2: R71.2 ; port LED_PWR_B

Not connected (* = marked no-connect by the designer): M4 1*; M5 1*

### Notes on the sheet
- Signal LEDs
- RGB LED Datasheet <http://www.inolux-corp.com/datasheet/SMDLED/RGB%20Side%20View/IN-S126TASRGB_V1.1.pdf>
- (in symbol 34EngineeringLogo) 34 Engineering

### Library data of the parts
D10-D13 = IN-S126TASRGB: LED Tri-Color Blue/Green/Red 470nm/523nm/625nm Automotive 4-Pin Chip 1206(3216Metric) T/R; Manufacturer: Inolux; Supplier 1: Digi-Key; Manufacturer Part Number: IN-S126TASRGB; RoHS: No; Category: LEDs; Stock 1: 49322; Pricing 1: 1=0.58000, 10=0.37900, 100=0.25070, 1000=0.19356 (USD); Supplier Part Number 1: 1830-1052-1-ND
LOGO1 = 34EngineeringLogo: 34 Engineering Silkscreen Logo
M4 M5 = MNT M3: Mounting hole for an M3 bolt
R60 R63 R66 R69 = CMP-2002-01170-1: Manufacturer: Panasonic; Part Number: ERJ2RKF68R0X
R61 R62 R64 R65 R67 R68 R70 R71 = CMP-1011-00302-2: Manufacturer: Panasonic; Part Number: ERJ-2RKF15R0X

## Sheet BoardC.SchDoc
size A; SheetNumber: 9; SheetTotal: 9
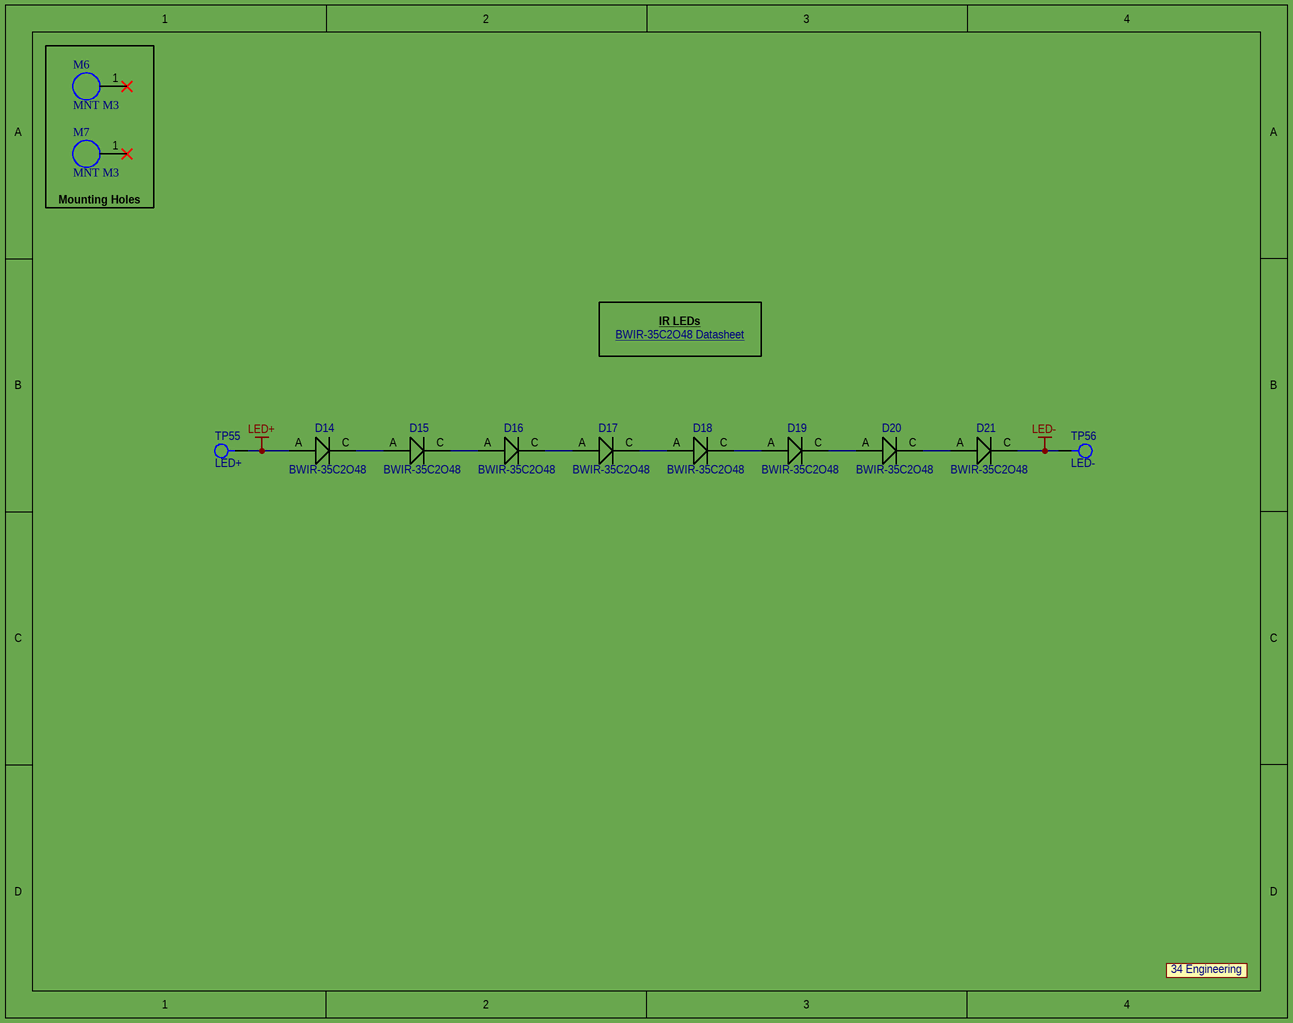
[diagram p8: BoardC.SchDoc]

### Parts
D14  BWIR-35C2O48  [BWIR-35C2O48]
D15  BWIR-35C2O48  [BWIR-35C2O48]
D16  BWIR-35C2O48  [BWIR-35C2O48]
D17  BWIR-35C2O48  [BWIR-35C2O48]
D18  BWIR-35C2O48  [BWIR-35C2O48]
D19  BWIR-35C2O48  [BWIR-35C2O48]
D20  BWIR-35C2O48  [BWIR-35C2O48]
D21  BWIR-35C2O48  [BWIR-35C2O48]
LOGO2  34 Engineering Logo  [34EngineeringLogo]  (value not drawn)
M6  MNT M3  [MNT M3]
M7  MNT M3  [MNT M3]
TP55  LED+  [TestPoint1mm]
TP56  LED-  [TestPoint1mm]

### Blocks framed on the sheet
Mounting Holes: M6 M7

### Nets
LED+: D14.A TP55.1
LED-: D21.C TP56.1
NetD14_C: D14.C D15.A
NetD15_C: D15.C D16.A
NetD16_C: D16.C D17.A
NetD17_C: D17.C D18.A
NetD18_C: D18.C D19.A
NetD19_C: D19.C D20.A
NetD20_C: D20.C D21.A

Not connected (* = marked no-connect by the designer): M6 1*; M7 1*

### Notes on the sheet
- IR LEDs
- BWIR-35C2O48 Datasheet <https://www.americanbrightled.com/pdffiles/ir-uv/ir/BWIR-35C2O48.pdf>
- (in symbol 34EngineeringLogo) 34 Engineering

### Library data of the parts
D14-D21 = BWIR-35C2O48: Infrared (IR) Emitter 850nm 1.7V 1A 260mW/sr @ 1A (Typ) 120° 1414 (3535 Metric); Manufacturer: American Bright; Supplier 1: Digi-Key; Manufacturer Part Number: BWIR-35C2O48; RoHS: No; Stock 1: 22417; Pricing 1: 1=2.11000, 10=1.40800, 100=1.08350, 500=0.97944, 1000=0.86625 (USD); Packaging: Tape and Reel; Supplier Part Number 1: BWIR-35C2O48CT-ND
LOGO2 = 34EngineeringLogo: 34 Engineering Silkscreen Logo
M6 M7 = MNT M3: Mounting hole for an M3 bolt
TP55 TP56 = TestPoint1mm: Test Point 1mm Diameter

## Nets that join several sheets
+1: BoardB-FPGA2 (17 pins), BoardB-FPGA3 (C?#52.1 TP?#13.1 U?#2.1)
+1.8: BoardB-FPGA2 (11 pins), BoardB-FPGA3 (C?#61.1 TP?#16.1 U?#5.1), BoardB-USB (7 pins)
+2.5: BoardB-FPGA2 (13 pins), BoardB-FPGA3 (C?#59.1 TP?#15.1 U?#4.1)
+3.3: BoardA-Power (10 pins), BoardA-Connectors (9 pins), BoardB-FPGA (C16.1 C17.1 R76.2 X1.1), BoardB-FPGA2 (43 pins), BoardB-FPGA3 (26 pins), BoardB-USB (19 pins), BoardB-Camera (18 pins), BoardB-LEDs (D10.3 D11.3 D12.3 D13.3)
+3.6: BoardA-Power (C98.1 U14.5), BoardB-Camera (C141.1 C144.1 U16.4 U16.6)
GND: BoardA-Power (38 pins), BoardA-Connectors (30 pins), BoardB-FPGA (6 pins), BoardB-FPGA2 (81 pins), BoardB-FPGA3 (24 pins), BoardB-USB (33 pins), BoardB-Camera (39 pins)
LED+: BoardA-Power (8 pins), BoardC (D14.A TP55.1)
LED-: BoardA-Power (5 pins), BoardC (D21.C TP56.1)
VCC: BoardA-Power (19 pins), BoardA-Connectors (6 pins)
CAM_CLK_N: BoardB-FPGA (U1.E5), BoardB-Camera (U3.7)
CAM_CLK_P: BoardB-FPGA (U1.F5), BoardB-Camera (U3.8)
CAM_DOUT0_N: BoardB-FPGA (U1.H4), BoardB-Camera (U3.9)
CAM_DOUT0_P: BoardB-FPGA (U1.H5), BoardB-Camera (U3.10)
CAM_DOUT1_N: BoardB-FPGA (U1.G1), BoardB-Camera (U3.11)
CAM_DOUT1_P: BoardB-FPGA (U1.G2), BoardB-Camera (U3.12)
CAM_DOUT2_N: BoardB-FPGA (U1.G4), BoardB-Camera (U3.13)
CAM_DOUT2_P: BoardB-FPGA (U1.G5), BoardB-Camera (U3.14)
CAM_DOUT3_N: BoardB-FPGA (U1.E1), BoardB-Camera (U3.15)
CAM_DOUT3_P: BoardB-FPGA (U1.F2), BoardB-Camera (U3.16)
CAM_MON0: BoardB-FPGA (U1.D16), BoardB-Camera (U3.44)
CAM_MON1: BoardB-FPGA (U1.F12), BoardB-Camera (U3.45)
CAM_RESET: BoardB-FPGA (U1.D15), BoardB-Camera (U3.46)
CAM_SPI_CLK: BoardB-FPGA (U1.E13), BoardB-Camera (TP51.1 U3.4)
CAM_SPI_CS: BoardB-FPGA (U1.E11), BoardB-Camera (TP52.1 U3.47)
CAM_SPI_MISO: BoardB-FPGA (U1.D14), BoardB-Camera (TP50.1 U3.3)
CAM_SPI_MOSI: BoardB-FPGA (U1.D11), BoardB-Camera (TP49.1 U3.2)
CAM_SYNC_N: BoardB-FPGA (U1.F3), BoardB-Camera (U3.17)
CAM_SYNC_P: BoardB-FPGA (U1.F4), BoardB-Camera (U3.18)
CAM_TRIG0: BoardB-FPGA (U1.E16), BoardB-Camera (U3.41)
CAM_TRIG1: BoardB-FPGA (U1.F13), BoardB-Camera (U3.42)
CAM_TRIG2: BoardB-FPGA (U1.F15), BoardB-Camera (U3.43)
CONF_CLK: BoardB-FPGA (U1.N13), BoardB-FPGA3 (TP?#11.1 U5#1.6)
CONF_CS: BoardB-FPGA (U1.P16), BoardB-FPGA3 (R?#16.1 TP?#7.1 U5#1.1)
CONF_HOLD: BoardB-FPGA (U1.T14), BoardB-FPGA3 (R?#17.2 TP?#9.1)
CONF_MISO: BoardB-FPGA (U1.R15), BoardB-FPGA3 (R?#18.1 TP?#8.1)
CONF_MOSI: BoardB-FPGA (U1.T15), BoardB-FPGA3 (R?#22.2 TP?#12.1)
CONF_WP: BoardB-FPGA (U1.R16), BoardB-FPGA3 (R?#21.1 TP?#10.1)
FLASH_CLK: BoardB-FPGA2 (U1.E8), BoardB-FPGA3 (TP?#5.1 U?#1.6)
FLASH_CS: BoardB-FPGA (U1.L12), BoardB-FPGA3 (R?#9.1 TP?#1.1 U?#1.1)
FLASH_SIO0: BoardB-FPGA (U1.J13), BoardB-FPGA3 (R?#15.2 TP?#6.1)
FLASH_SIO1: BoardB-FPGA (U1.J14), BoardB-FPGA3 (R?#11.1 TP?#2.1)
FLASH_SIO2: BoardB-FPGA (U1.K15), BoardB-FPGA3 (R?#14.1 TP?#4.1)
FLASH_SIO3: BoardB-FPGA (U1.K16), BoardB-FPGA3 (R?#10.2 TP?#3.1)
NetR1_1: BoardA-Connectors (R1.1 TP1.1 U4.4), BoardB-FPGA (U1.N12)
NetR3_1: BoardA-Connectors (R3.1 TP2.1 U6.4), BoardB-FPGA (U1.N11)
NetR5_1: BoardA-Connectors (R5.1 TP4.1 U7.5), BoardB-FPGA (U1.A13)
NetR7_1: BoardA-Power (U13.12), BoardB-FPGA (R7.1 TP6.1 U1.C8 U1.C9)
NetR51_2: BoardA-Power (R51.2 U13.9), BoardB-FPGA (U1.D10)
NetR60_2: BoardB-FPGA2 (U1.M5 U1.P1), BoardB-LEDs (R60.2)
NetR61_2: BoardB-FPGA2 (U1.N2 U1.P4), BoardB-LEDs (R61.2)
NetR62_2: BoardB-FPGA2 (U1.N1 U1.P3), BoardB-LEDs (R62.2)
NetR63_2: BoardB-FPGA (U1.A8 U1.A9), BoardB-LEDs (R63.2)
NetR64_2: BoardB-FPGA (U1.A10 U1.B9), BoardB-LEDs (R64.2)
NetR65_2: BoardB-FPGA (U1.B10 U1.B11), BoardB-LEDs (R65.2)
NetR66_2: BoardB-FPGA2 (U1.R1 U1.T4), BoardB-LEDs (R66.2)
NetR67_2: BoardB-FPGA2 (U1.N4 U1.R3), BoardB-LEDs (R67.2)
NetR68_2: BoardB-FPGA2 (U1.R2 U1.T2), BoardB-LEDs (R68.2)
NetR69_2: BoardB-FPGA2 (U1.M4 U1.N3), BoardB-LEDs (R69.2)
NetR70_2: BoardB-FPGA2 (U1.L5 U1.M2), BoardB-LEDs (R70.2)
NetR71_2: BoardB-FPGA2 (U1.L4 U1.M1), BoardB-LEDs (R71.2)
USB_BC0: BoardB-FPGA (U1.T5), BoardB-USB (TP20.1 U2.48)
USB_BC1: BoardB-FPGA (U1.P9), BoardB-USB (TP21.1 U2.52)
USB_BC2: BoardB-FPGA (U1.N9), BoardB-USB (TP23.1 U2.53)
USB_BC3: BoardB-FPGA (U1.T10), BoardB-USB (TP24.1 U2.54)
USB_BC4: BoardB-FPGA (U1.R10), BoardB-USB (TP25.1 U2.55)
USB_BC5: BoardB-FPGA (U1.P10), BoardB-USB (TP26.1 U2.57)
USB_BC6: BoardB-FPGA (U1.R11), BoardB-USB (TP27.1 U2.58)
USB_BD0: BoardB-FPGA (U1.P8), BoardB-USB (TP12.1 U2.38)
USB_BD1: BoardB-FPGA (U1.R8), BoardB-USB (TP13.1 U2.39)
USB_BD2: BoardB-FPGA (U1.T8), BoardB-USB (TP14.1 U2.40)
USB_BD3: BoardB-FPGA (U1.R7), BoardB-USB (TP15.1 U2.41)
USB_BD4: BoardB-FPGA (U1.T7), BoardB-USB (TP16.1 U2.43)
USB_BD5: BoardB-FPGA (U1.P6), BoardB-USB (TP17.1 U2.44)
USB_BD6: BoardB-FPGA (U1.R6), BoardB-USB (TP18.1 U2.45)
USB_BD7: BoardB-FPGA (U1.R5), BoardB-USB (TP19.1 U2.46)
USB_N: BoardA-Connectors (D1.2 J1.A7 J1.B7), BoardB-USB (U2.7)
USB_P: BoardA-Connectors (D2.2 J1.A6 J1.B6), BoardB-USB (U2.8)
USB_PWREN: BoardB-FPGA (U1.R12), BoardB-USB (TP31.1 U2.60)
USB_PWRSAV: BoardA-Connectors (R6.1 R75.2), BoardB-FPGA (U1.T12), BoardB-USB (TP28.1 U2.59)
USB_SUS: BoardB-FPGA (U1.T9), BoardB-USB (TP30.1 U2.36)
USB_TCK: BoardB-FPGA2 (U1.L7), BoardB-USB (R17.2 TP8.1)
USB_TDI: BoardB-FPGA2 (U1.N7), BoardB-USB (R18.2 TP9.1)
USB_TDO: BoardB-FPGA2 (U1.N8), BoardB-USB (R19.2 TP10.1)
USB_TMS: BoardB-FPGA2 (U1.M7), BoardB-USB (R20.2 TP11.1)
VREFN: BoardB-FPGA2 (C?#46.1 U1.H7), BoardB-FPGA3 (C?#57.2 FB?#4.2 U?#3.4)
VREFP: BoardB-FPGA2 (C?#46.2 U1.J8), BoardB-FPGA3 (C?#57.1 TP?#14.1 U?#3.8)